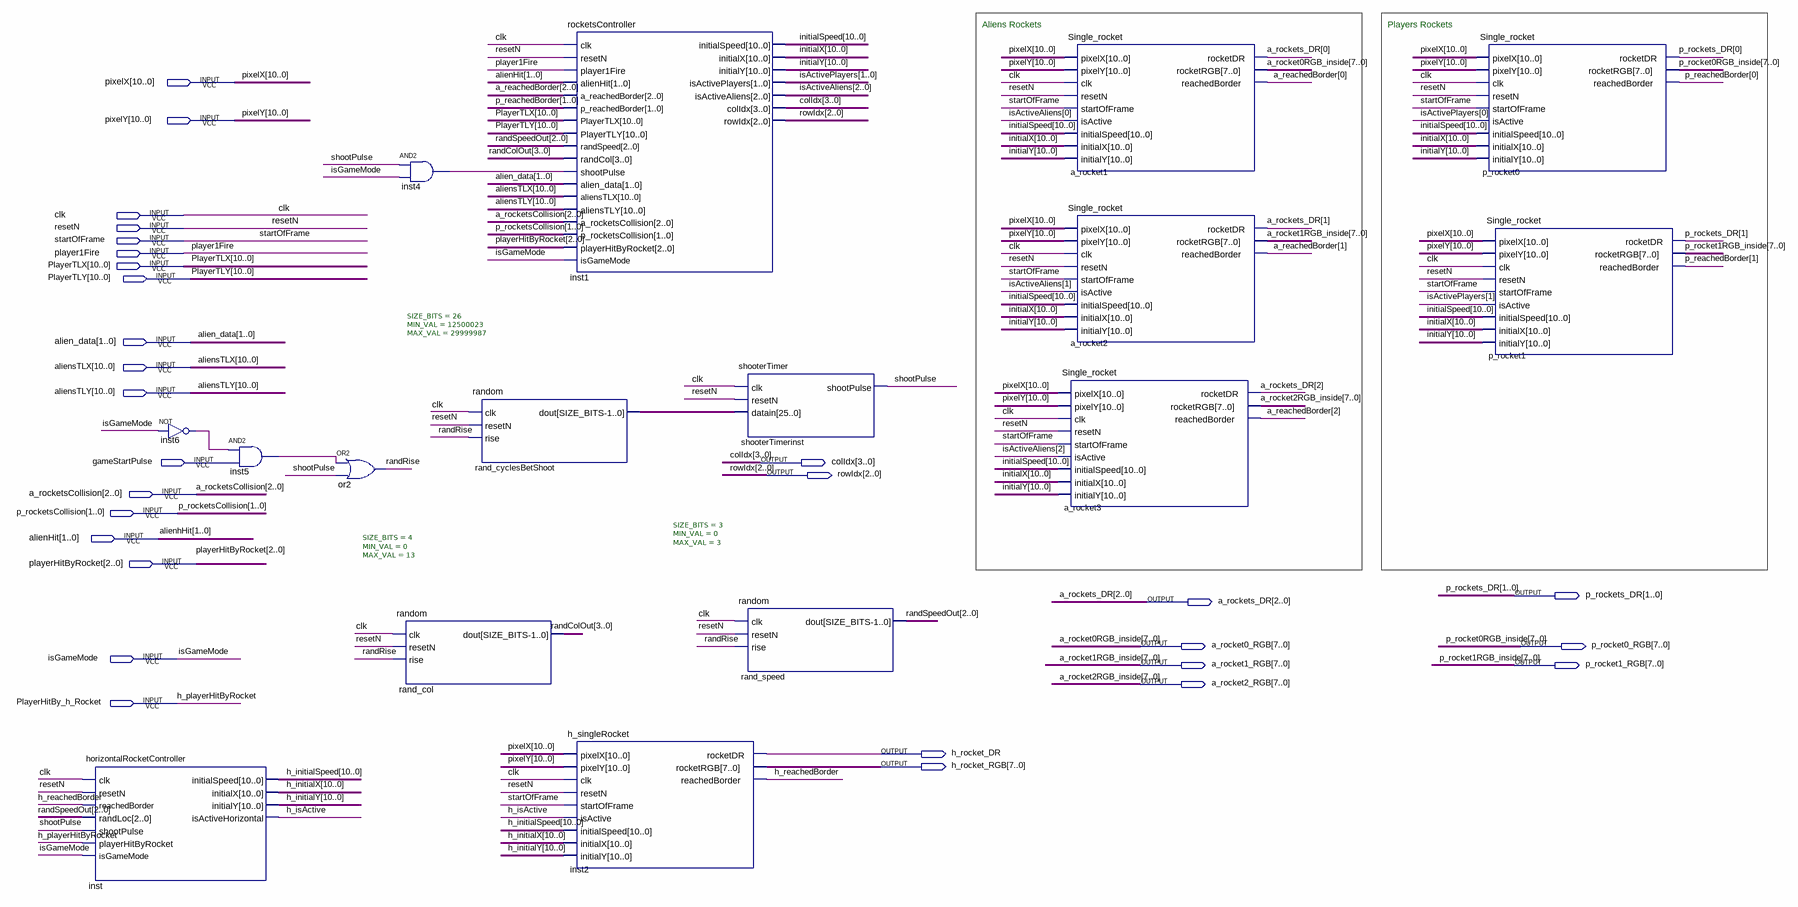
[diagram p0: schematic sheet]
// Quartus schematic rockets.bdf as structural Verilog: 16 symbols, 29 pins
module rockets (
  input  [10:0] pixelX,
  input  [10:0] pixelY,
  input  clk,
  input  resetN,
  input  startOfFrame,
  input  player1Fire,
  input  [10:0] PlayerTLX,
  input  [10:0] PlayerTLY,
  input  [1:0] alien_data,
  input  [10:0] aliensTLX,
  input  [10:0] aliensTLY,
  input  gameStartPulse,
  input  [2:0] a_rocketsCollision,
  input  [1:0] p_rocketsCollision,
  input  [1:0] alienHit,
  input  [2:0] playerHitByRocket,
  input  isGameMode,
  input  PlayerHitBy_h_Rocket,
  output [3:0] colIdx,
  output [2:0] rowIdx,
  output [1:0] p_rockets_DR,
  output [2:0] a_rockets_DR,
  output [7:0] a_rocket0_RGB,
  output [7:0] p_rocket0_RGB,
  output [7:0] a_rocket1_RGB,
  output [7:0] p_rocket1_RGB,
  output [7:0] a_rocket2_RGB,
  output h_rocket_DR,
  output [7:0] h_rocket_RGB
);

  wire h_isActive, h_reachedBorder, inst4_out, inst5_out, inst6_out, randRise, shootPulse;
  wire [1:0] isActivePlayers, p_reachedBorder;
  wire [2:0] a_reachedBorder, isActiveAliens, randSpeedOut;
  wire [3:0] randColOut;
  wire [10:0] h_initialSpeed, h_initialX, h_initialY, initialSpeed, initialX, initialY;
  wire [25:0] rand_cyclesBetShoot_dout;

  horizontalRocketController inst (
    .clk(clk), .resetN(resetN), .reachedBorder(h_reachedBorder), .randLoc(randSpeedOut),
    .shootPulse(shootPulse), .playerHitByRocket(PlayerHitBy_h_Rocket), .isGameMode(isGameMode),
    .initialSpeed(h_initialSpeed), .initialX(h_initialX), .initialY(h_initialY),
    .isActiveHorizontal(h_isActive));
  not inst6 (inst6_out, isGameMode);
  and inst5 (inst5_out, inst6_out, gameStartPulse);
  or or2 (randRise, inst5_out, shootPulse);
  and inst4 (inst4_out, shootPulse, isGameMode);
  random #(.SIZE_BITS(4), .MIN_VAL(0), .MAX_VAL(13)) rand_col (
    .clk(clk), .resetN(resetN), .rise(randRise), .dout(randColOut));
  random #(.SIZE_BITS(26), .MIN_VAL(12500023), .MAX_VAL(29999987)) rand_cyclesBetShoot (
    .clk(clk), .resetN(resetN), .rise(randRise), .dout(rand_cyclesBetShoot_dout));
  rocketsController inst1 (
    .clk(clk), .resetN(resetN), .player1Fire(player1Fire), .alienHit(alienHit),
    .a_reachedBorder(a_reachedBorder), .p_reachedBorder(p_reachedBorder), .PlayerTLX(PlayerTLX),
    .PlayerTLY(PlayerTLY), .randSpeed(randSpeedOut), .randCol(randColOut), .shootPulse(inst4_out),
    .alien_data(alien_data), .aliensTLX(aliensTLX), .aliensTLY(aliensTLY),
    .a_rocketsCollision(a_rocketsCollision), .p_rocketsCollision(p_rocketsCollision),
    .playerHitByRocket(playerHitByRocket), .isGameMode(isGameMode), .initialSpeed(initialSpeed),
    .initialX(initialX), .initialY(initialY), .isActivePlayers(isActivePlayers),
    .isActiveAliens(isActiveAliens), .colIdx(colIdx), .rowIdx(rowIdx));
  h_singleRocket inst2 (
    .pixelX(pixelX), .pixelY(pixelY), .clk(clk), .resetN(resetN), .startOfFrame(startOfFrame),
    .isActive(h_isActive), .initialSpeed(h_initialSpeed), .initialX(h_initialX), .initialY(h_initialY),
    .rocketDR(h_rocket_DR), .rocketRGB(h_rocket_RGB), .reachedBorder(h_reachedBorder));
  shooterTimer shooterTimerinst (
    .clk(clk), .resetN(resetN), .datain(rand_cyclesBetShoot_dout), .shootPulse(shootPulse));
  random #(.SIZE_BITS(3), .MIN_VAL(0), .MAX_VAL(3)) rand_speed (
    .clk(clk), .resetN(resetN), .rise(randRise), .dout(randSpeedOut));
  Single_rocket a_rocket1 (
    .pixelX(pixelX), .pixelY(pixelY), .clk(clk), .resetN(resetN), .startOfFrame(startOfFrame),
    .isActive(isActiveAliens[0]), .initialSpeed(initialSpeed), .initialX(initialX), .initialY(initialY),
    .rocketDR(a_rockets_DR[0]), .rocketRGB(a_rocket0_RGB), .reachedBorder(a_reachedBorder[0]));
  Single_rocket a_rocket2 (
    .pixelX(pixelX), .pixelY(pixelY), .clk(clk), .resetN(resetN), .startOfFrame(startOfFrame),
    .isActive(isActiveAliens[1]), .initialSpeed(initialSpeed), .initialX(initialX), .initialY(initialY),
    .rocketDR(a_rockets_DR[1]), .rocketRGB(a_rocket1_RGB), .reachedBorder(a_reachedBorder[1]));
  Single_rocket a_rocket3 (
    .pixelX(pixelX), .pixelY(pixelY), .clk(clk), .resetN(resetN), .startOfFrame(startOfFrame),
    .isActive(isActiveAliens[2]), .initialSpeed(initialSpeed), .initialX(initialX), .initialY(initialY),
    .rocketDR(a_rockets_DR[2]), .rocketRGB(a_rocket2_RGB), .reachedBorder(a_reachedBorder[2]));
  Single_rocket p_rocket0 (
    .pixelX(pixelX), .pixelY(pixelY), .clk(clk), .resetN(resetN), .startOfFrame(startOfFrame),
    .isActive(isActivePlayers[0]), .initialSpeed(initialSpeed), .initialX(initialX), .initialY(initialY),
    .rocketDR(p_rockets_DR[0]), .rocketRGB(p_rocket0_RGB), .reachedBorder(p_reachedBorder[0]));
  Single_rocket p_rocket1 (
    .pixelX(pixelX), .pixelY(pixelY), .clk(clk), .resetN(resetN), .startOfFrame(startOfFrame),
    .isActive(isActivePlayers[1]), .initialSpeed(initialSpeed), .initialX(initialX), .initialY(initialY),
    .rocketDR(p_rockets_DR[1]), .rocketRGB(p_rocket1_RGB), .reachedBorder(p_reachedBorder[1]));

  // Other names for the same wires on the sheet: a_rocket0RGB_inside[7:0] = a_rocket0_RGB;
  //   a_rocket1RGB_inside[7:0] = a_rocket1_RGB; a_rocket2RGB_inside[7:0] = a_rocket2_RGB; alienhHit[1:0] = alienHit;
  //   h_playerHitByRocket = PlayerHitBy_h_Rocket; p_rocket0RGB_inside[7:0] = p_rocket0_RGB;
  //   p_rocket1RGB_inside[7:0] = p_rocket1_RGB

  // Notes on the sheet:
  //   Aliens Rockets
  //   Players Rockets
endmodule
